# Altium schematic sheet Battery_Charger.SchDoc
size A3; DocumentNumber: 9; SheetNumber: 9; SheetTotal: 11
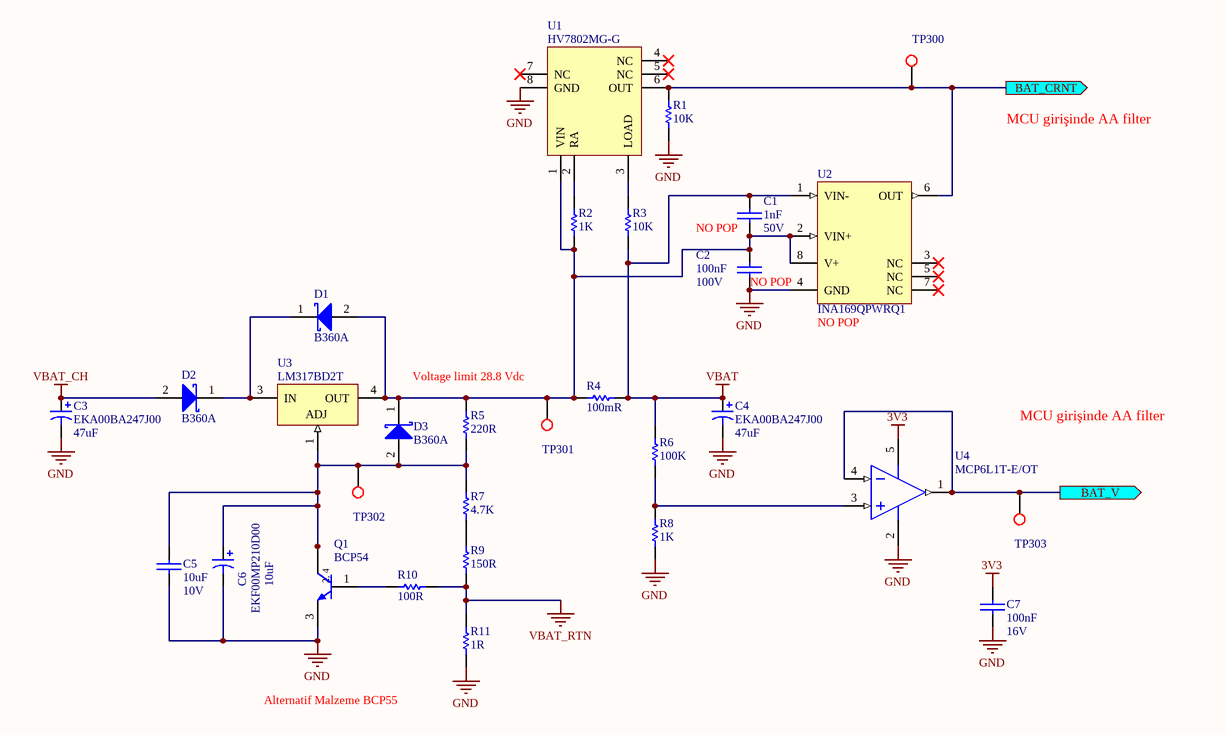
[diagram p0: Battery_Charger.SchDoc]

## Parts
C1  Operating Voltage: 50V  Assembly: NO POP  [CAPC1005X06N]  (hidden comment: 1nF)
C2  Operating Voltage: 100V  Assembly: NO POP  [CAPC3216X09N]  (hidden comment: 100nF)
C3  EKA00BA247J00  value 47uF  [CAPPR2.5-6.3X11]
C4  EKA00BA247J00  value 47uF  [CAPPR2.5-6.3X11]
C5  Operating Voltage: 10V  [CAPC2012X09N]  (hidden comment: 10uF)
C6  EKF00MP210D00  value 10uF  [CAPPR1.5-4X5]
C7  Operating Voltage: 16V  [CAPC1005X06N]  (hidden comment: 100nF)
D1  B360A  [DIOM5226X23N]
D2  B360A  [DIOM5226X23N]
D3  B360A  [DIOM5226X23N]
Q1  BCP54  [SOT-223B_N]
R1  10K  [RESC1005X04N]
R2  1K  [RESC1005X04N]
R3  10K  [RESC1005X04N]
R4  100mR  [RESC3216X08N]
R5  220R  [RESC2012X07N]
R6  100K  [RESC1005X04N]
R7  4.7K  [RESC2012X07N]
R8  1K  [RESC1005X04N]
R9  150R  [RESC2012X07N]
R10  100R  [RESC2012X07N]
R11  1R  [RESC3225X06N]
TP300  AEMT-C00S-1000-0000  [TP100]  (value not drawn)
TP301  AEMT-C00S-1000-0000  [TP100]  (value not drawn)
TP302  AEMT-C00S-1000-0000  [TP100]  (value not drawn)
TP303  AEMT-C00S-1000-0000  [TP100]  (value not drawn)
U1  HV7802MG-G  [MSOP65P490X110-8N]
U2  Assembly: NO POP  [TSOP65P640X120-8N]  (hidden comment: INA169QPWRQ1)
U3  LM317BD2T  [936-03]
U4  MCP6L1T-E/OT  [SOT-23-OT5_N]

## Ports
BAT_CRNT (out), BAT_V (out)

## Nets
3V3: C7.2 U4.5(VDD)
GND: C2.1 C3.2 C4.2 C5.1 C6.2 C7.1 Q1.3(E) R1.1 R8.1 R11.1 U1.8(GND) U2.4(GND) U4.2(VSS)
VBAT: C1.2 C4.1 R3.1 R4.2 R6.2 U2.1(VIN-)
VBAT_CH: C3.1 D2.2(A)
VBAT_RTN: R9.1 R10.2 R11.2
BAT_CRNT: R1.2 TP300.1 U1.6(OUT) U2.6(OUT) ; port BAT_CRNT
BAT_V: TP303.1 U4.1(VOUT) U4.4(VIN-) ; port BAT_V
NetC1_1: C1.1 C2.2 D1.2(A) D3.1(K) R2.1 R4.1 R5.2 TP301.1 U1.1(VIN) U2.2(VIN+) U2.8(V+) U3.4(OUT)
NetC5_2: C5.2 C6.1 D3.2(A) Q1.2(C) Q1.4(C) R5.1 R7.2 TP302.1 U3.1(ADJ)
NetD1_1: D1.1(K) D2.1(K) U3.3(IN)
NetQ1_1: Q1.1(B) R10.1
NetR2_2: R2.2 U1.2(RA)
NetR3_2: R3.2 U1.3(LOAD)
NetR6_1: R6.1 R8.2 U4.3(VIN+)
NetR7_1: R7.1 R9.2

Not connected (* = marked no-connect by the designer): U1 4(NC)* 5(NC)* 7(NC)*; U2 3(NC)* 5(NC)* 7(NC)*

## Notes on the sheet
- MCU girişinde AA filter
- Voltage limit 28.8 Vdc
- Alternatif Malzeme BCP55
- Title
- Size:
- Date:
- A3
- Number:
- Time:
- Revision:
- Sheet
- of
- File:
- (in symbol BCP54) 2, 4

## Library data of the parts
C1 = ACC0-0100-S272-0000: CAP, CER, C0G, 1nF, %5, 50V, 0402; Manufacturer: Murata; Manufacturer Part Number: GRM1555C1H102JA01D; CR: 000049; Requested by: MU; Lead Finish: Pb Free; Material: Ceramic, C0G; Definition Date: 14.08.2012; Revision Date: *; Price: *; Supplier: *; Supplier Part Number: *; DS: 000049; Operating Temp: -55 to 125 C; Storage Temp: -55 to 125 C; Status: Active; Package Reference: EIA 0402, Metric 1005; Component Type: Capacitor; Footprint Type: SMD; Published by: MU; ESR: *; FR: *; Value: 1nF
C2 = ACC7-2100-S791-0000: CAP, CER, X7R, 100nF, %10, 100V, 1206; Manufacturer: KEMET; Manufacturer Part Number: C1206C104K1RACTU; CR: 000211/89; Requested by: OO; DS: 000211; Lead Finish: Pb Free; Published by: MU; Material: Ceramic, X7R; Definition Date: 18.02.2013; Revision Date: *; Price: *; Supplier: *; Supplier Part Number: *; Operating Temp: -55 to 125 C; Storage Temp: -55 to 125 C; Status: Active; Package Reference: EIA 1206, Metric 3216; Component Type: Capacitor; Footprint Type: SMD; ESR: *; FR: *; Value: 100nF
C3 C4 = EKA00BA247J00: Aluminum Electrolytic Capacitor, Radial Style with Long Leads: 47uF, 63V; Note: Refer to Manufacturer's Data Sheets for other lead formations; DrillSize: Nominal, Rounded To The Nearest 0.1mm; Published: 19-Mar-2004; DatasheetDocument: 20-Feb-2001; PackageReference: CAPPR2.5-6.3X11; Publisher: Altium Limited; ComponentLink1Description: Manufacturer Link; ComponentLink1URL: http://www.vishay.com/; ComponentLink2Description: Datasheet; ComponentLink2URL: http://www.vishay.com/docs/25014/eka.pdf
C5 = ACC7-4100-S431-0000: CAP, CER, X7R, 10uF, %10, 10V, 0805; Manufacturer: Murata; Manufacturer Part Number: GRM21BR71A106KE51L; CR: 000049; Requested by: MAY; Lead Finish: Pb Free; Published by: MU; Material: Ceramic, X7R; Definition Date: 22.10.2012; Revision Date: *; Price: *; Supplier: *; Supplier Part Number: *; DS: 000049; Operating Temp: -55 to 125 C; Storage Temp: -55 to 125 C; Status: Active; Package Reference: EIA 0805, Metric 2012; Component Type: Capacitor; Footprint Type: SMD; ESR: *; FR: *; Value: 10uF
C6 = EKF00MP210D00: Aluminum Electrolytic Capacitor, Radial Style with Long Leads: 10uF, 16V; Note: Refer to Manufacturer's Data Sheets for other lead formations; DrillSize: Nominal, Rounded To The Nearest 0.05mm; Published: 19-Mar-2004; DatasheetDocument: 13-Jan-2000; PackageReference: CAPPR1.5-4X5; Publisher: Altium Limited; ComponentLink1Description: Manufacturer Link; ComponentLink1URL: http://www.vishay.com/; ComponentLink2Description: Datasheet; ComponentLink2URL: http://www.vishay.com/docs/25004/ekf.pdf
C7 = ACC7-2100-S241-0000: CAP, CER, X7R, 100nF, %10, 16V, 0402; Manufacturer: Murata; Manufacturer Part Number: GRM155R71C104KA88D; CR: 000049; Requested by: MU; Lead Finish: Pb Free; Material: Ceramic, X7R; Definition Date: 14.08.2012; Revision Date: *; Price: *; Supplier: *; Supplier Part Number: *; DS: 000049; Operating Temp: -55 to 125 C; Storage Temp: -55 to 125 C; Status: Active; Package Reference: EIA 0402, Metric 1005; Component Type: Capacitor; Footprint Type: SMD; Published by: MU; ESR: *; FR: *; Value: 100nF
D1-D3 = AS15-930M-SI60-0001: Diode, Schottky, 0.7V @3A, 60V, SMA; Manufacturer Part Number: B360A-13-F; Manufacturer: Diodes; CR: 000101; Lead Finish: Pb Free; Published by: MU; Requested by: TK; Price: *; DS: 000101; Definition Date: 22.03.2013; Footprint Type: SMD; JEDEC Code: *; Operating Temp: -55 to 150 C; Package Reference: SMA; Revision Date: *; Status: Active; Storage Temp: -55 to 150 C; Supplier: *; Supplier Part Number: *; Component Type: DIODE; Forward Voltage: 0.7V @3A; Reverse Voltage: 60V; Value: B360A
Q1 = BCP54: NPN General Purpose Amplifier; Published: 8-Jun-2000; LatestRevisionDate: 20-Nov-2009; LatestRevisionNote: IPC-7351 Footprint Added.; DatasheetVersion: 1997; PackageVersion: Aug-1999; PackageReference: SOT-223B; Publisher: Altium Limited; PackageDescription: 4-Pin SOT-223 Package 2.3 mm Pitch, 7 mm Lead Span; ComponentLink1Description: Manufacturer Link; ComponentLink1URL: http://www.fairchildsemi.com/; ComponentLink2Description: Datasheet; ComponentLink2URL: http://www.fairchildsemi.com/ds/BC%2FBCP54.pdf
R1 R3 = AR19-4100-S2B2-0000: RES, E24, Thick Film, SMD, 10K, 1%, 0.1W, 0402; Manufacturer: Panasonic; Manufacturer Part Number: ERJ-2RKF1002X; CR: DS00073; Requested by: MU; Lead Finish: Pb Free; Max. Operating Voltage: 50V; Definition Date: 16.08.2012; Revision Date: *; Price: *; Supplier: *; Supplier Part Number: *; DS: DS00073; Operating Temp: -55 to 155 C; Storage Temp: -55 to 155 C; Status: Active; Package Reference: EIA 0402, Metric 1005; Component Type: Resistor; Footprint Type: SMD; Published by: MU; JEDEC Code: *; Material: Thick Film; ESR: *; FR: *; Power Rating: 0.1W; Value: 10K
R2 R8 = AR19-3100-S2B2-0000: RES, E24, Thick Film, SMD, 1K, 1%, 0.1W, 0402; Manufacturer: Panasonic; Manufacturer Part Number: ERJ-2RKF1001X; CR: DS00073; Requested by: MU; Lead Finish: Pb Free; Max. Operating Voltage: 50V; Definition Date: 16.08.2012; Revision Date: *; Price: *; Supplier: *; Supplier Part Number: *; DS: DS00073; Operating Temp: -55 to 155 C; Storage Temp: -55 to 155 C; Status: Active; Package Reference: EIA 0402, Metric 1005; Component Type: Resistor; Footprint Type: SMD; Published by: MU; JEDEC Code: *; Material: Thick Film; ESR: *; FR: *; Power Rating: 0.1W; Value: 1K
R4 = AR19-Z100-S5D2-0000: RES, Thick Film, SMD, 100mR, 1%, 1W, 1206; Manufacturer: Panasonic; Manufacturer Part Number: ERJ-8BWFR100V; CR: 000078; Requested by: MU; Lead Finish: Pb Free; Max. Operating Voltage: 0.40; Definition Date: 14.02.2013; Revision Date: *; Price: *; Supplier: *; Supplier Part Number: *; DS: 000078; Operating Temp: -55 to 155 C; Storage Temp: -55 to 155 C; Status: Active; Package Reference: EIA 1206, Metric 3216; Component Type: Resistor; Footprint Type: SMD; Published by: MU; JEDEC Code: *; Material: Thick Film; ESR: *; FR: *; Power Rating: 1W; Value: 100mR
R5 = AR19-2220-S4B2-0000: RES, E24, Thick Film, SMD, 220R, 1%, 0.125W, 0805; Manufacturer: Panasonic; Manufacturer Part Number: ERJ-6ENF2200V; CR: DS00073; Requested by: MAY; Lead Finish: Pb Free; Published by: MU; Max. Operating Voltage: 150V; Definition Date: 09.11.2012; Revision Date: *; Price: *; Supplier: *; Supplier Part Number: *; DS: DS00073; Operating Temp: -55 to 155 C; Storage Temp: -55 to 155 C; Status: Active; Package Reference: EIA 0805, Metric 2012; Component Type: Resistor; Footprint Type: SMD; JEDEC Code: *; Material: Thick Film; ESR: *; FR: *; Power Rating: 0.125W; Value: 220R
R6 = AR19-5100-S2B2-0000: RES, E24, Thick Film, SMD, 100K, 1%, 0.1W, 0402; Manufacturer: Panasonic; Manufacturer Part Number: ERJ-2RKF1003X; CR: DS00073; Requested by: MU; Lead Finish: Pb Free; Max. Operating Voltage: 50V; Definition Date: 16.08.2012; Revision Date: *; Price: *; Supplier: *; Supplier Part Number: *; DS: DS00073; Operating Temp: -55 to 155 C; Storage Temp: -55 to 155 C; Status: Active; Package Reference: EIA 0402, Metric 1005; Component Type: Resistor; Footprint Type: SMD; Published by: MU; JEDEC Code: *; Material: Thick Film; ESR: *; FR: *; Power Rating: 0.1W; Value: 100K
R7 = AR19-3470-S4B2-0000: RES, E24, Thick Film, SMD, 4.7K, 1%, 0.125W, 0805; Manufacturer: Panasonic; Manufacturer Part Number: ERJ-6ENF4701V; CR: 000073; Requested by: OO; Lead Finish: Pb Free; Published by: MU; Max. Operating Voltage: 150V; Definition Date: 16.02.2013; Revision Date: *; Price: *; Supplier: *; Supplier Part Number: *; DS: 000073; Operating Temp: -55 to 155 C; Storage Temp: -55 to 155 C; Status: Active; Package Reference: EIA 0805, Metric 2012; Component Type: Resistor; Footprint Type: SMD; JEDEC Code: *; Material: Thick Film; ESR: *; FR: *; Power Rating: 0.125W; Value: 4.7K
R9 = AR19-2150-S4B2-0000: RES, E24, Thick Film, SMD, 150R, 1%, 0.125W, 0805; Manufacturer: Panasonic; Manufacturer Part Number: ERJ-6ENF1500V; CR: DS00073; Requested by: MAY; Lead Finish: Pb Free; Published by: MU; Max. Operating Voltage: 150V; Definition Date: 09.11.2012; Revision Date: *; Price: *; Supplier: *; Supplier Part Number: *; DS: DS00073; Operating Temp: -55 to 155 C; Storage Temp: -55 to 155 C; Status: Active; Package Reference: EIA 0805, Metric 2012; Component Type: Resistor; Footprint Type: SMD; JEDEC Code: *; Material: Thick Film; ESR: *; FR: *; Power Rating: 0.125W; Value: 150R
R10 = AR19-2100-S4B2-0000: RES, E24, Thick Film, SMD, 100R, 1%, 0.125W, 0805; Manufacturer: Panasonic; Manufacturer Part Number: ERJ-6ENF1000V; CR: DS00073; Requested by: MAY; Lead Finish: Pb Free; Published by: MU; Max. Operating Voltage: 150V; Definition Date: 09.11.2012; Revision Date: *; Price: *; Supplier: *; Supplier Part Number: *; DS: DS00073; Operating Temp: -55 to 155 C; Storage Temp: -55 to 155 C; Status: Active; Package Reference: EIA 0805, Metric 2012; Component Type: Resistor; Footprint Type: SMD; JEDEC Code: *; Material: Thick Film; ESR: *; FR: *; Power Rating: 0.125W; Value: 100R
R11 = AR19-0100-S6B2-0000: RES, Thick Film, SMD, 1R, 1%, 0.5W, 1210; Manufacturer: Vishay; Manufacturer Part Number: CRCW12101R00FKEA; CR: 000234/117; Requested by: NK; DS: 000234; Lead Finish: Pb Free; Published by: MU; Max. Operating Voltage: 200; Definition Date: 27.02.2013; Revision Date: *; Price: *; Supplier: *; Supplier Part Number: *; Operating Temp: -55 to 155 C; Storage Temp: -55 to 155 C; Status: Active; Package Reference: EIA 1210, Metric 3226; Component Type: Resistor; Footprint Type: SMD; JEDEC Code: *; Material: Thick Film; ESR: *; FR: *; Power Rating: 0.5W; Value: 1R
TP300-TP303 = AEMT-C00S-1000-0000: Test Point, Circular, 1mm; Text: TEST_POINT
U1 = AT82-0000-SMC0-1860: IC, PMIC, Current Monitor, HV7802MG-G, MSOP-8; Manufacturer: Microchip; JEDEC Code: MO-187; Lead Finish: Pb Free; Published by: NK; Component Type: IC; CR: -; Definition Date: 01.08.2015; DS: -; Footprint Type: SMD; Manufacturer Part Number: HV7802MG-G; Operating Temp: -40°C to 85°C; Package Reference: MSOP-8; Price: *; Requested by: NK; Revision Date: -; Status: Active; Storage Temp: -65°C to 150°C; Supplier: *; Supplier Part Number: *; FR: *; Value: HV7802MG-G
U2 = AT82-0000-SM90-0690: IC, PMIC, Current Monitor, INA169QPWRQ1, TSSOP-8; Manufacturer: Texas Instruments; CR: 000177; JEDEC Code: MO-153; Lead Finish: Pb Free; Published by: MU; Requested by: OO; Component Type: IC; Definition Date: 20.12.2012; DS: 000177; Footprint Type: SMD; Manufacturer Part Number: INA169QPWRQ1; Operating Temp: -40°C to 125°C; Package Reference: TSSOP-8; Price: *; Revision Date: 27.05.2013; Status: Active; Storage Temp: -65°C to 150°C; Supplier: *; Supplier Part Number: *; FR: *; Value: INA169QPWRQ1
U3 = LM317BD2T: Three-Terminal Adjustable Output Positive Voltage Regulator; Note: Pin 2 is electrically connected to Pin 4; Pin 4 is heasink; Published: 15-Apr-2002; DatasheetVersion: 1996; PackageVersion: 1997; PackageReference: 936-03; Publisher: Altium Limited; PackageDescription: D2-PAK/TO-263-AB; 3 Leads (1 Cropped); Body 14.7 (inc. leads) x 10.2 mm (LxW max); ComponentLink1Description: Manufacturer Link; ComponentLink1URL: http://www.onsemi.com/site/products/taxonomy/0,4438,503,00.html; ComponentLink2Description: Datasheet; ComponentLink2URL: http://www.onsemi.com/pub/Collateral/LM317-D.PDF
U4 = MCP6L1T-E/OT: 2.8 MHz, 200 µA Op Amp, 5-Pin SOT-23, Extended Temperature Range, Tape and Reel; Manufacturer: Microchip; DatasheetVersion: revC, Jan-2012; PackageVersion: revBB, Aug-2009; PackageReference: SOT-23-OT5; PackageDescription: 5-Lead Plastic Small Outline Transistor (OT) [SOT-23]; Supplier 1: Digi-Key; Supplier Part Number 1: MCP6L1T-E/OTTR-ND; Supplier 2: Digi-Key; Supplier Part Number 2: MCP6L1T-E/OTCT-ND; Supplier 3: Digi-Key; Supplier Part Number 3: MCP6L1T-E/OTDKR-ND; Supplier 4: Newark; Supplier Part Number 4: 06R3494; Supplier 5: Mouser; Supplier Part Number 5: 579-MCP6L1T-E/OT; Mounting Technology: Surface Mount; Code_IPC: SOT23-5; PartNumber: MCP6L1T-E/OT; ComponentLink1Description: Manufacturer URL; ComponentLink1URL: http://www.microchip.com/; ComponentLink2Description: Datasheet; ComponentLink2URL: http://ww1.microchip.com/downloads/en/DeviceDoc/22135C.pdf; ComponentLink3Description: Package Specification; ComponentLink3URL: http://www.microchip.com/stellent/groups/techpub_sg/documents/packagingspec/en012702.pdf